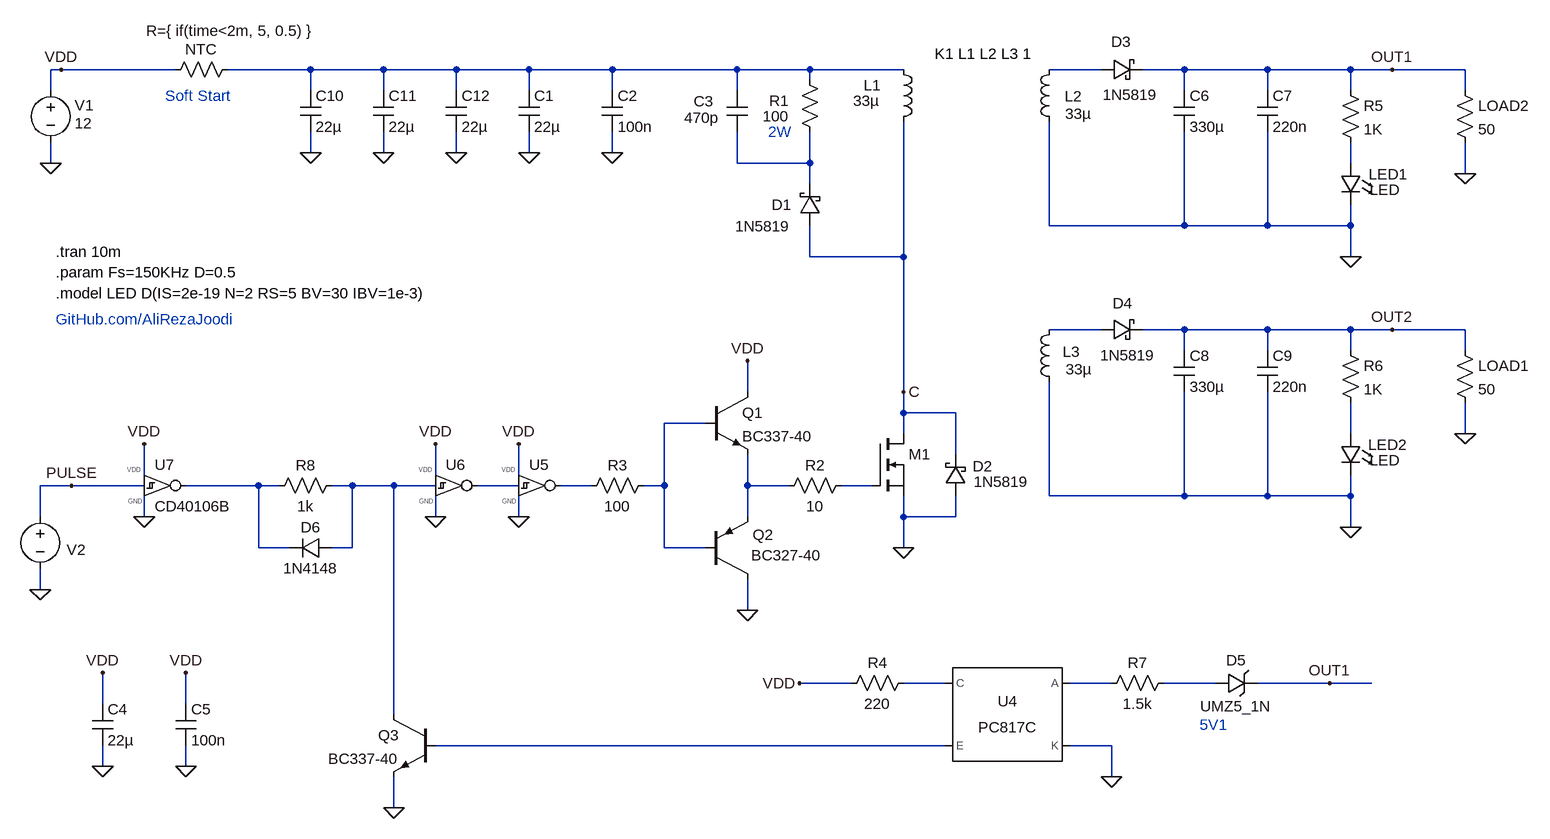
[diagram p0: schematic v1.1.asc]
v1.1.asc, the LTspice schematic file:
Version 4.1
SHEET 1 2620 1460
WIRE -80 192 -96 192
WIRE 96 192 -80 192
WIRE 304 192 176 192
WIRE 416 192 304 192
WIRE 528 192 416 192
WIRE 640 192 528 192
WIRE 768 192 640 192
WIRE 960 192 768 192
WIRE 1072 192 960 192
WIRE 1216 192 1072 192
WIRE 1520 192 1440 192
WIRE 1648 192 1584 192
WIRE 1776 192 1648 192
WIRE 1904 192 1776 192
WIRE 1968 192 1904 192
WIRE 2080 192 1968 192
WIRE 1072 208 1072 192
WIRE -96 224 -96 192
WIRE 304 224 304 192
WIRE 416 224 416 192
WIRE 528 224 528 192
WIRE 640 224 640 192
WIRE 768 224 768 192
WIRE 960 224 960 192
WIRE 1648 224 1648 192
WIRE 1776 224 1776 192
WIRE 1904 224 1904 192
WIRE 2080 224 2080 192
WIRE 304 320 304 288
WIRE 416 320 416 288
WIRE 528 320 528 288
WIRE 640 320 640 288
WIRE 768 320 768 288
WIRE -96 336 -96 304
WIRE 960 336 960 288
WIRE 1072 336 1072 288
WIRE 1072 336 960 336
WIRE 1904 336 1904 304
WIRE 2080 352 2080 304
WIRE 1072 368 1072 336
WIRE 1440 432 1440 272
WIRE 1648 432 1648 288
WIRE 1648 432 1440 432
WIRE 1776 432 1776 288
WIRE 1776 432 1648 432
WIRE 1904 432 1904 400
WIRE 1904 432 1776 432
WIRE 1072 480 1072 432
WIRE 1216 480 1216 272
WIRE 1216 480 1072 480
WIRE 1904 480 1904 432
WIRE 1520 592 1440 592
WIRE 1648 592 1584 592
WIRE 1776 592 1648 592
WIRE 1904 592 1776 592
WIRE 1968 592 1904 592
WIRE 2080 592 1968 592
WIRE 1648 624 1648 592
WIRE 1776 624 1776 592
WIRE 1904 624 1904 592
WIRE 2080 624 2080 592
WIRE 976 688 976 640
WIRE 1216 688 1216 480
WIRE 1216 720 1216 688
WIRE 1296 720 1216 720
WIRE 912 736 848 736
WIRE 1216 752 1216 720
WIRE 1904 752 1904 704
WIRE 2080 752 2080 704
WIRE 1296 784 1296 720
WIRE 48 816 48 768
WIRE 496 816 496 768
WIRE 624 816 624 768
WIRE -64 832 -112 832
WIRE 48 832 -64 832
WIRE 224 832 112 832
WIRE 256 832 224 832
WIRE 368 832 336 832
WIRE 432 832 368 832
WIRE 496 832 432 832
WIRE 624 832 560 832
WIRE 736 832 688 832
WIRE 848 832 848 736
WIRE 848 832 816 832
WIRE 976 832 976 784
WIRE 1040 832 976 832
WIRE 1168 832 1120 832
WIRE 1440 848 1440 672
WIRE 1648 848 1648 688
WIRE 1648 848 1440 848
WIRE 1776 848 1776 688
WIRE 1776 848 1648 848
WIRE 1904 848 1904 816
WIRE 1904 848 1776 848
WIRE -112 880 -112 832
WIRE 48 880 48 848
WIRE 496 880 496 848
WIRE 624 880 624 848
WIRE 976 880 976 832
WIRE 1216 880 1216 848
WIRE 1296 880 1296 848
WIRE 1296 880 1216 880
WIRE 1904 896 1904 848
WIRE 224 928 224 832
WIRE 272 928 224 928
WIRE 368 928 368 832
WIRE 368 928 336 928
WIRE 848 928 848 832
WIRE 912 928 848 928
WIRE 1216 928 1216 880
WIRE -112 992 -112 960
WIRE 976 1024 976 976
WIRE 1136 1136 1056 1136
WIRE 1280 1136 1216 1136
WIRE 1536 1136 1472 1136
WIRE 1696 1136 1616 1136
WIRE 1872 1136 1760 1136
WIRE 1936 1136 1872 1136
WIRE -16 1168 -16 1120
WIRE 112 1168 112 1120
WIRE 432 1184 432 832
WIRE 1280 1232 496 1232
WIRE 1536 1232 1472 1232
WIRE -16 1264 -16 1232
WIRE 112 1264 112 1232
WIRE 1536 1280 1536 1232
WIRE 432 1328 432 1280
FLAG -96 336 0
FLAG -112 992 0
FLAG -64 832 PULSE
FLAG 1216 928 0
FLAG 640 320 0
FLAG 768 320 0
FLAG 1904 896 0
FLAG 1968 592 OUT2
FLAG -80 192 VDD
FLAG 976 640 VDD
FLAG 976 1024 0
FLAG 48 880 0
FLAG 48 768 VDD
FLAG 496 880 0
FLAG 496 768 VDD
FLAG 624 880 0
FLAG 624 768 VDD
FLAG 432 1328 0
FLAG 1056 1136 VDD
FLAG -16 1120 VDD
FLAG -16 1264 0
FLAG 112 1264 0
FLAG 528 320 0
FLAG 416 320 0
FLAG 304 320 0
FLAG 1904 480 0
FLAG 1968 192 OUT1
FLAG 112 1120 VDD
FLAG 2080 752 0
FLAG 2080 352 0
FLAG 1216 688 C
FLAG 1536 1280 0
FLAG 1872 1136 OUT1
SYMBOL voltage -96 208 R0
WINDOW 123 0 0 Left 0
WINDOW 39 24 105 Left 2
WINDOW 0 37 39 Left 2
WINDOW 3 37 67 Left 2
SYMATTR InstName V1
SYMATTR Value 12
SYMBOL voltage -112 864 R0
WINDOW 123 0 0 Left 0
WINDOW 39 0 0 Left 0
WINDOW 0 41 67 Left 2
WINDOW 3 -361 80 Invisible 2
SYMATTR InstName V2
SYMATTR Value PULSE(0 9 0 {0.01/Fs} {0.01/Fs} {D/Fs} {1/Fs})
SYMBOL ind 1200 176 R0
WINDOW 0 -45 40 Left 2
WINDOW 3 -61 64 Left 2
SYMATTR InstName L1
SYMATTR Value 33µ
SYMATTR SpiceLine Rser=0.07
SYMATTR Type ind
SYMBOL cap 976 288 R180
WINDOW 0 52 47 Left 2
WINDOW 3 43 22 Left 2
SYMATTR InstName C3
SYMATTR Value 470p
SYMBOL res 1088 304 R180
WINDOW 0 48 64 Left 2
WINDOW 3 48 40 Left 2
SYMATTR InstName R1
SYMATTR Value 100
SYMATTR SpiceLine pwr=2
SYMBOL nmos 1168 752 R0
WINDOW 3 56 72 Invisible 2
SYMATTR Value BSC100N06LS3
SYMATTR InstName M1
SYMBOL cap 624 224 R0
SYMATTR InstName C1
SYMATTR Value 22µ
SYMBOL schottky 1088 432 R180
WINDOW 0 44 32 Left 2
WINDOW 3 131 -1 Right 2
SYMATTR InstName D1
SYMATTR Value 1N5819
SYMBOL cap 752 224 R0
SYMATTR InstName C2
SYMATTR Value 100n
SYMBOL schottky 1312 848 R180
WINDOW 0 -41 46 Left 2
WINDOW 3 -97 22 Left 2
SYMATTR InstName D2
SYMATTR Value 1N5819
SYMBOL ind 1456 688 R180
WINDOW 0 -32 62 Left 2
WINDOW 3 -50 35 Left 2
SYMATTR InstName L3
SYMATTR Value 33µ
SYMATTR SpiceLine Rser=0.07
SYMATTR Type ind
SYMBOL schottky 1520 608 R270
WINDOW 0 41 33 VTop 2
WINDOW 3 -8 41 VBottom 2
SYMATTR InstName D4
SYMATTR Value 1N5819
SYMBOL cap 1632 624 R0
SYMATTR InstName C8
SYMATTR Value 330µ
SYMBOL cap 1760 624 R0
SYMATTR InstName C9
SYMATTR Value 220n
SYMBOL res 1888 608 R0
SYMATTR InstName R6
SYMATTR Value 1K
SYMBOL npn 912 688 R0
SYMATTR InstName Q1
SYMATTR Value BC337-40
SYMBOL pnp 912 976 M180
WINDOW 0 72 68 Left 2
WINDOW 3 70 37 Left 2
SYMATTR InstName Q2
SYMATTR Value BC327-40
SYMBOL res 1024 848 R270
WINDOW 0 32 56 VTop 2
WINDOW 3 0 56 VBottom 2
SYMATTR InstName R2
SYMATTR Value 10
SYMBOL res 720 848 R270
WINDOW 0 32 56 VTop 2
WINDOW 3 0 56 VBottom 2
SYMATTR InstName R3
SYMATTR Value 100
SYMBOL res 240 848 R270
WINDOW 0 32 56 VTop 2
WINDOW 3 0 56 VBottom 2
SYMATTR InstName R8
SYMATTR Value 1k
SYMBOL diode 336 912 R90
WINDOW 0 0 32 VBottom 2
WINDOW 3 32 32 VTop 2
SYMATTR InstName D6
SYMATTR Value 1N4148
SYMBOL npn 496 1184 M0
SYMATTR InstName Q3
SYMATTR Value BC337-40
SYMBOL res 1120 1152 R270
WINDOW 0 32 56 VTop 2
WINDOW 3 0 56 VBottom 2
SYMATTR InstName R4
SYMATTR Value 220
SYMBOL Optos\\PC817C 1376 1184 M0
SYMATTR InstName U4
SYMBOL zener 1696 1120 M90
WINDOW 0 -4 32 VBottom 2
WINDOW 3 36 32 VTop 2
SYMATTR InstName D5
SYMATTR Value UMZ5_1N
SYMBOL cap -32 1168 R0
SYMATTR InstName C4
SYMATTR Value 22µ
SYMBOL cap 96 1168 R0
SYMATTR InstName C5
SYMATTR Value 100n
SYMBOL cap 512 224 R0
SYMATTR InstName C12
SYMATTR Value 22µ
SYMBOL cap 400 224 R0
SYMATTR InstName C11
SYMATTR Value 22µ
SYMBOL cap 288 224 R0
SYMATTR InstName C10
SYMATTR Value 22µ
SYMBOL ind 1456 288 R180
WINDOW 0 -35 55 Left 2
WINDOW 3 -9 28 Right 2
SYMATTR InstName L2
SYMATTR Value 33µ
SYMATTR SpiceLine Rser=0.07
SYMATTR Type ind
SYMBOL schottky 1520 208 R270
WINDOW 0 43 31 VTop 2
WINDOW 3 -7 45 VBottom 2
SYMATTR InstName D3
SYMATTR Value 1N5819
SYMBOL cap 1632 224 R0
SYMATTR InstName C6
SYMATTR Value 330µ
SYMBOL cap 1760 224 R0
SYMATTR InstName C7
SYMATTR Value 220n
SYMBOL res 1888 208 R0
SYMATTR InstName R5
SYMATTR Value 1K
SYMBOL res 80 208 R270
WINDOW 0 32 56 VTop 2
WINDOW 3 91 100 VBottom 2
SYMATTR InstName NTC
SYMATTR Value R={ if(time<2m, 5, 0.5) }
SYMBOL MyLib\\Digital\\CD40106B 624 800 R0
WINDOW 38 16 64 Invisible 2
SYMATTR InstName U5
SYMBOL MyLib\\Digital\\CD40106B 496 800 R0
WINDOW 38 16 64 Invisible 2
SYMATTR InstName U6
SYMBOL MyLib\\Digital\\CD40106B 48 800 R0
SYMATTR InstName U7
SYMBOL LED 1920 336 M0
WINDOW 0 -72 17 Left 2
WINDOW 3 -60 41 Left 2
SYMATTR InstName LED1
SYMATTR Value LED
SYMBOL LED 1920 752 M0
WINDOW 0 -71 17 Left 2
WINDOW 3 -60 41 Left 2
SYMATTR InstName LED2
SYMATTR Value LED
SYMBOL res 2064 608 R0
SYMATTR InstName LOAD1
SYMATTR Value 50
SYMBOL res 2064 208 R0
SYMATTR InstName LOAD2
SYMATTR Value 50
SYMBOL res 1632 1120 R90
WINDOW 0 0 56 VBottom 2
WINDOW 3 32 56 VTop 2
SYMATTR InstName R7
SYMATTR Value 1.5k
TEXT -88 472 Left 2 !.tran 10m
TEXT 1264 168 Left 2 !K1 L1 L2 L3 1
TEXT -88 504 Left 2 !.param Fs=150KHz D=0.5
TEXT 80 232 Left 2 ;Soft Start
TEXT -88 536 Left 2 !.model LED D(IS=2e-19 N=2 RS=5 BV=30 IBV=1e-3)
TEXT -88 576 Left 2 ;GitHub.com/AliRezaJoodi
TEXT 1672 1200 Left 2 ;5V1
TEXT 1008 288 Left 2 ;2W

The netlist it stands for:
* v1.1.asc
V1 VDD 0 12
V2 PULSE 0 PULSE(0 9 0 {0.01/Fs} {0.01/Fs} {D/Fs} {1/Fs})
L1 N001 C 33µ Rser=0.07
C3 N003 N001 470p
R1 N003 N001 100 pwr=2
M1 C N013 0 0 BSC100N06LS3
C1 N001 0 22µ
D1 C N003 1N5819
C2 N001 0 100n
D2 0 C 1N5819
L3 0 N005 33µ Rser=0.07
D4 N005 OUT2 1N5819
C8 OUT2 0 330µ
C9 OUT2 0 220n
R6 OUT2 N007 1K
Q1 VDD N006 N012 0 BC337-40
Q2 0 N006 N012 0 BC327-40
R2 N012 N013 10
R3 N011 N006 100
R8 N008 N009 1k
D6 N009 N008 1N4148
Q3 N009 N017 0 0 BC337-40
R4 VDD N014 220
X§U4 N015 0 N014 N017 PC817 Igain=2.3m  ; PC817C, pins A K C E
D5 N016 OUT1 UMZ5_1N
C4 VDD 0 22µ
C5 VDD 0 100n
C12 N001 0 22µ
C11 N001 0 22µ
C10 N001 0 22µ
L2 0 N002 33µ Rser=0.07
D3 N002 OUT1 1N5819
C6 OUT1 0 330µ
C7 OUT1 0 220n
R5 OUT1 N004 1K
R§NTC VDD N001 R={ if(time<2m, 5, 0.5) }
X§U5 N010 N011 VDD 0 CD40106B vdd=5 speed=2 tripdt=100n  ; pins in out VDD GND
X§U6 N009 N010 VDD 0 CD40106B vdd=5 speed=2 tripdt=100n  ; pins in out VDD GND
X§U7 PULSE N008 VDD 0 CD40106B vdd=5 speed=2 tripdt=100n  ; pins in out VDD GND
D§LED1 N004 0 LED
D§LED2 N007 0 LED
R§LOAD1 OUT2 0 50
R§LOAD2 OUT1 0 50
R7 N016 N015 1.5k
.model D D
.lib standard.dio
.model NPN NPN
.model PNP PNP
.lib standard.bjt
.model NMOS NMOS
.model PMOS PMOS
.lib standard.mos
.tran 10m
K1 L1 L2 L3 1
.param Fs=150KHz D=0.5
* Soft Start
.model LED D(IS=2e-19 N=2 RS=5 BV=30 IBV=1e-3)
* GitHub.com/AliRezaJoodi
* 5V1
* 2W
.lib PC817.sub
.lib MyLib/Digital/_CD4xxx.lib
.backanno
.end